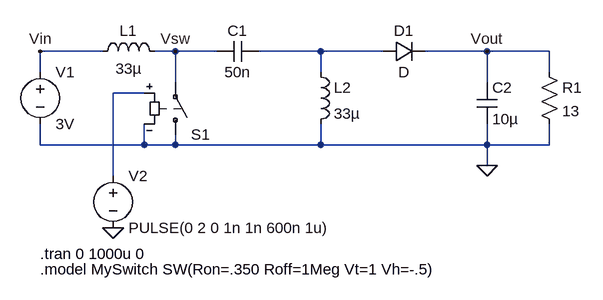
[diagram p0: schematic SEPIC.asc]
SEPIC.asc, the LTspice schematic file:
Version 4.1
SHEET 1 944 680
WIRE 16 112 -80 112
WIRE 128 112 96 112
WIRE 192 112 128 112
WIRE 352 112 256 112
WIRE 448 112 352 112
WIRE 608 112 512 112
WIRE 704 112 608 112
WIRE -80 144 -80 112
WIRE 352 144 352 112
WIRE 704 144 704 112
WIRE 128 160 128 112
WIRE 608 160 608 112
WIRE 80 176 32 176
WIRE -80 256 -80 224
WIRE 80 256 80 224
WIRE 80 256 -80 256
WIRE 128 256 128 240
WIRE 128 256 80 256
WIRE 352 256 352 224
WIRE 352 256 128 256
WIRE 608 256 608 224
WIRE 608 256 352 256
WIRE 704 256 704 224
WIRE 704 256 608 256
WIRE 608 288 608 256
WIRE 32 304 32 176
FLAG 608 288 0
FLAG 32 384 0
FLAG 128 112 Vsw
FLAG 608 112 Vout
FLAG -80 112 Vin
SYMBOL ind 0 128 R270
WINDOW 0 32 56 VTop 2
WINDOW 3 5 56 VBottom 2
SYMATTR InstName L1
SYMATTR Value 33µ
SYMATTR SpiceLine Rser=1m
SYMBOL ind 336 128 R0
SYMATTR InstName L2
SYMATTR Value 33µ
SYMATTR SpiceLine Rser=1m
SYMBOL cap 256 96 R90
WINDOW 0 0 32 VBottom 2
WINDOW 3 32 32 VTop 2
SYMATTR InstName C1
SYMATTR Value 50n
SYMBOL diode 448 128 R270
WINDOW 0 32 32 VTop 2
WINDOW 3 0 32 VBottom 2
SYMATTR InstName D1
SYMBOL res 688 128 R0
SYMATTR InstName R1
SYMATTR Value 13
SYMBOL cap 592 160 R0
SYMATTR InstName C2
SYMATTR Value 10µ
SYMBOL sw 128 256 M180
WINDOW 3 24 96 Invisible 2
SYMATTR InstName S1
SYMATTR Value MySwitch
SYMBOL voltage -80 128 R0
WINDOW 123 0 0 Left 0
WINDOW 39 0 0 Left 0
SYMATTR InstName V1
SYMATTR Value 3V
SYMBOL voltage 32 288 R0
WINDOW 123 0 0 Left 0
WINDOW 39 0 0 Left 0
SYMATTR InstName V2
SYMATTR Value PULSE(0 2 0 1n 1n 600n 1u)
TEXT -80 424 Left 2 !.tran 0 1000u 0
TEXT -80 448 Left 2 !.model MySwitch SW(Ron=.350 Roff=1Meg Vt=1 Vh=-.5)

The netlist it stands for:
* SEPIC.asc
L1 Vin Vsw 33µ Rser=1m
L2 N001 0 33µ Rser=1m
C1 N001 Vsw 50n
D1 N001 Vout D
R1 Vout 0 13
C2 Vout 0 10µ
S1 0 Vsw N002 0 MySwitch
V1 Vin 0 3V
V2 N002 0 PULSE(0 2 0 1n 1n 600n 1u)
.model D D
.lib standard.dio
.tran 0 1000u 0
.model MySwitch SW(Ron=.350 Roff=1Meg Vt=1 Vh=-.5)
.backanno
.end